# Altium schematic sheet Main.SchDoc: TAUV-Modem: Main
size A; DrawnBy: Theo Chemel; Revision: A; SheetNumber: 1; SheetTotal: 3
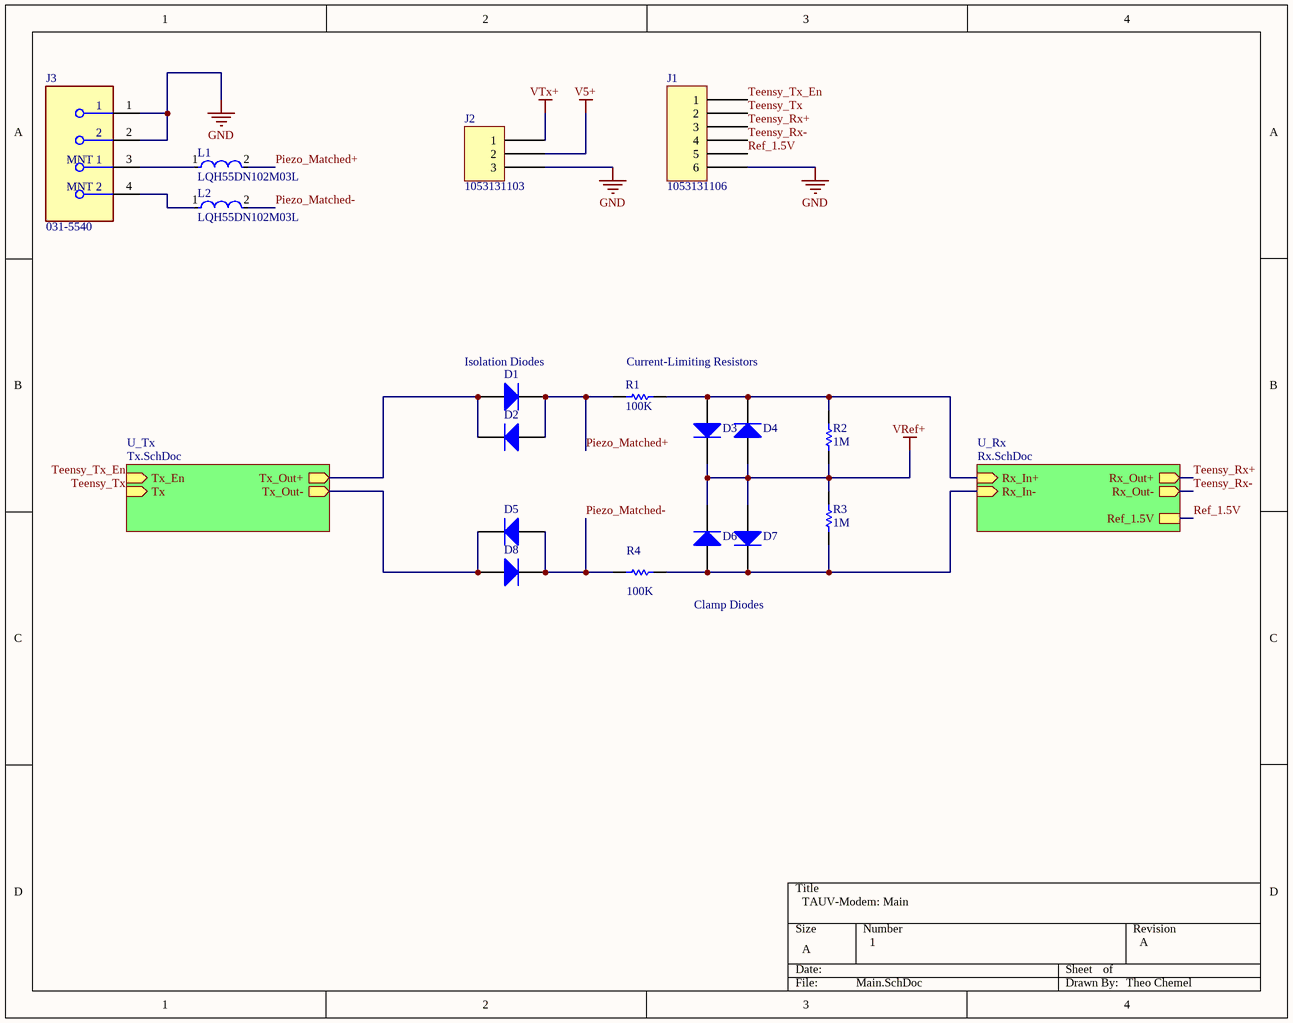
[diagram p0: Main.SchDoc]

## Parts
D1  Diode  [SOD-123F]  (value not drawn)
D2  Diode  [SOD-123F]  (value not drawn)
D3  Diode  [SOD-123F]  (value not drawn)
D4  Diode  [SOD-123F]  (value not drawn)
D5  Diode  [SOD-123F]  (value not drawn)
D6  Diode  [SOD-123F]  (value not drawn)
D7  Diode  [SOD-123F]  (value not drawn)
D8  Diode  [SOD-123F]  (value not drawn)
J1  1053131106  [MOLEX 1053131106]
J2  1053131103  [MOLEX 1053131103]
J3  031-5540  [FP-031-5540-MFG]
L1  LQH55DN102M03L  [FP-LQH55DN_03-MFG]
L2  LQH55DN102M03L  [FP-LQH55DN_03-MFG]
R1  value 100K  [0805]  (hidden comment: Resistor)
R2  value 1M  [0805]  (hidden comment: Resistor)
R3  value 1M  [0805]  (hidden comment: Resistor)
R4  value 100K  [0805]  (hidden comment: Resistor)

## Sub-sheets
U_Rx = Rx.SchDoc: Rx_In+ (in), Rx_In- (in), Ref_1.5V, Rx_Out+ (out), Rx_Out- (out)
U_Tx = Tx.SchDoc: Tx_En (in), Tx (in), Tx_Out+ (out), Tx_Out- (out)

## Nets
GND: J1.6 J2.3 J3.1 J3.2
V5+: J2.2
VRef+: D3.2(K) D4.1(A) D6.2(K) D7.1(A) R2.1 R3.2
VTx+: J2.1
Piezo_Matched+: D1.2(K) D2.1(A) L1.2 R1.1
Piezo_Matched-: D5.1(A) D8.2(K) L2.2 R4.1
Ref_1.5V: J1.5 ; sheet U_Rx/Ref_1.5V
Teensy_Rx+: J1.3 ; sheet U_Rx/Rx_Out+
Teensy_Rx-: J1.4 ; sheet U_Rx/Rx_Out-
Teensy_Tx: J1.2 ; sheet U_Tx/Tx
Teensy_Tx_En: J1.1 ; sheet U_Tx/Tx_En
NetD1_1: D1.1(A) D2.2(K) ; sheet U_Tx/Tx_Out+
NetD3_1: D3.1(A) D4.2(K) R1.2 R2.2 ; sheet U_Rx/Rx_In+
NetD5_2: D5.2(K) D8.1(A) ; sheet U_Tx/Tx_Out-
NetD6_1: D6.1(A) D7.2(K) R3.1 R4.2 ; sheet U_Rx/Rx_In-
NetJ3_3: J3.3(MNT_1) L1.1
NetJ3_4: J3.4(MNT_2) L2.1

## Notes on the sheet
- (near D1) Isolation Diodes
- (near R1) Current-Limiting Resistors
- Clamp Diodes

## Library data of the parts
D1-D8 = Diode: AF: 1; BV: 0; BV_MAX: 1e99; EG: 1.11; FC: 0.5; IBV: 0.001; ISR: 1e-14; MJSW: 0.33; NTUN: 30; TNOM: 27; XTI: 3; SimulationGenericComponent: True; CJO: 0; CJP: 0; CTA: 0; CTP: 0; FCS: 0.5; FV_MAX: 1e99; IKF: 0; IKR: 0; JSW: 0; JTUN: 0; JTUNSW: 0; KEG: 1; KF: 0; LEVEL: 1; N: 1; NBV: 1; NR: 1; NS: 1; PHP: 1; RS: 0; TCV: 0; TLEV: 0; TLEVC: 0; TM1: 0; TM2: 0; TPB: 0; TPHP: 0; TRS: 0; TRS2: 0; TT: 0; TTT1: 0; TTT2: 0; VJ: 1; XTITUN: 3; IS: 1e-14
J1 = 1053131106: CONN HEADER R/A 6POS 2.5MM; Manufacturer: Molex; Contact Length - Post: 0.126" (3.20mm); Number of Positions: 6; Number of Positions Loaded: All; Pitch - Mating: 0.098" (2.50mm); Row Spacing - Mating: -40°C ~ 105°C; Shrouding: Shrouded - 4 Wall; Style: Board to Cable/Wire; Part Number: 1053131106; ComponentLink1Description: Datasheet; ComponentLink1URL: https://www.molex.com/pdm_docs/ps/PS-105300-100-001.pdf; ComponentLink2Description: DigiKey Link; ComponentLink2URL: https://www.digikey.com/en/products/detail/molex/1053131106/7693178; Connector Type: Header; Contact Finish - Mating: Tin; Contact Finish - Post: Tin; Contact Finish Thickness - Mating: 59.0µin (1.50µm); Contact Material: Brass; Contact Shape: Square; Contact Type: Male Pin; Fastening Type: Latch Holder; Features: Board Guide; Insulation Color: Black; Insulation Height: 0.149" (3.78mm); Insulation Material: Liquid Crystal Polymer (LCP); LastUpdated: 8/11/2022 9:49:49 AM; Lifecycle Status: Active; Minimum Order: 1; Mounting Type: Through Hole, Right Angle; Number of Rows: 1; Operating Temperature: -40°C ~ 105°C; Packaging: Tray; PartId: 145; Part Status: Active; Price: 0.75; Series: Nano-Fit 105313; Supplier 1: DigiKey; Supplier Part Number 1: WM16897-ND; Termination: Solder
J2 = 1053131103: CONN HEADER R/A 3POS 2.5MM; Manufacturer: Molex; Contact Length - Post: 0.126" (3.20mm); Number of Positions: 3; Number of Positions Loaded: All; Pitch - Mating: 0.098" (2.50mm); Row Spacing - Mating: -40°C ~ 105°C; Shrouding: Shrouded - 4 Wall; Style: Board to Cable/Wire; Part Number: 1053131103; ComponentLink1Description: Datasheet; ComponentLink1URL: http://www.literature.molex.com/SQLImages/kelmscott/Molex/PDF_Images/987651-1223.PDF; ComponentLink2Description: DigiKey Link; ComponentLink2URL: http://digikey.com/product-detail/en/molex/1053131103/WM16894-ND/7693175; Connector Type: Header; Contact Finish - Mating: Tin; Contact Finish - Post: Tin; Contact Finish Thickness - Mating: 59.0µin (1.50µm); Contact Material: Brass; Contact Shape: Square; Contact Type: Male Pin; Fastening Type: Latch Holder; Features: Board Guide; Insulation Color: Black; Insulation Height: 0.149" (3.78mm); Insulation Material: Liquid Crystal Polymer (LCP); LastUpdated: 8/11/2022 9:48:02 AM; Lifecycle Status: Active; Minimum Order: 1; Mounting Type: Through Hole, Right Angle; Number of Rows: 1; Operating Temperature: -40°C ~ 105°C; Packaging: Tray; PartId: 142; Part Status: Active; Price: 0.95; Series: Nano-Fit 105313; Supplier 1: DigiKey; Supplier Part Number 1: WM16894-ND; Termination: Solder
J3 = CMP-20040-000002-1: CONN BNC RCPT R/A 50 OHM PCB; Manufacturer: Amphenol RF; Impedance: 50Ω; Number Of Contacts: 2; Pitch: 2.54mm; Dielectric Material: Polypropylene; Is Female: yes; Frequency: 1GHz; Conn Orientation: Right Angle; Lead Free: Yes; Device Class L2: RF / Coaxial Connectors; Digikey Description: CONN BNC RCPT R/A 50 OHM PCB; Octopart: https://octopart.com/031-5540-amphenol+rf-49742301; ComponentLink2URL: https://www.amphenolrf.com/downloads/dl/file/id/2040/product/579/031_5540_customer_drawing.pdf; Package: 0; Automotive: No; Temperature: -55°C to +85°C; Contact Material: Gold,Nickel; RoHS: TRUE; ComponentLink2Description: Datasheet; Height: 13.4mm; Category: Conn; Manufacturer Part Number: 031-5540; Temperature Range High: +85°C; Device Class L3: unset; Temperature Range Low: -55°C; Device Class L1: Connectors
L1 L2 = CMP-06042-004467-1: Wire Wound Ferrite Inductor for Power Lines 1000μH ±20% 14.42Ω  0.15A 2220; Series Resistance: 10.3R; Self Resonant Frequency: 1.7MHz; Test Frequency: 10kHz; Shielding: Unshielded; Max DC Current: 150mA; Inductance: 1mH; Weight: 0.016932oz; Tolerance: 20%; Max Operating Temperature: 80°C; DC Resistance (DCR): 10.3R; Military Standard: Not; Height - Seated (Max): 0.198inch; Radiation Hardening: No; Min Operating Temperature: -40°C; Lead Free: Lead Free; Case/Package: 2220; Width: 0.197inch; Resistor Type: Wirewound; Depth: 5.3mm; Termination: SMD/SMT; Case Code (Metric): 5750; Height: 0.197inch; Case Code (Imperial): 2220; Core Material: Ferrite; Package Quantity: 350; Mount: Surface Mount; Packaging: Tape and Reel; Current Rating: 150mA; DC Current: 150mA; Length: 0.224inch
R1-R4 = Resistor: TC1: 0; SimulationGenericComponent: True; TC2: 0